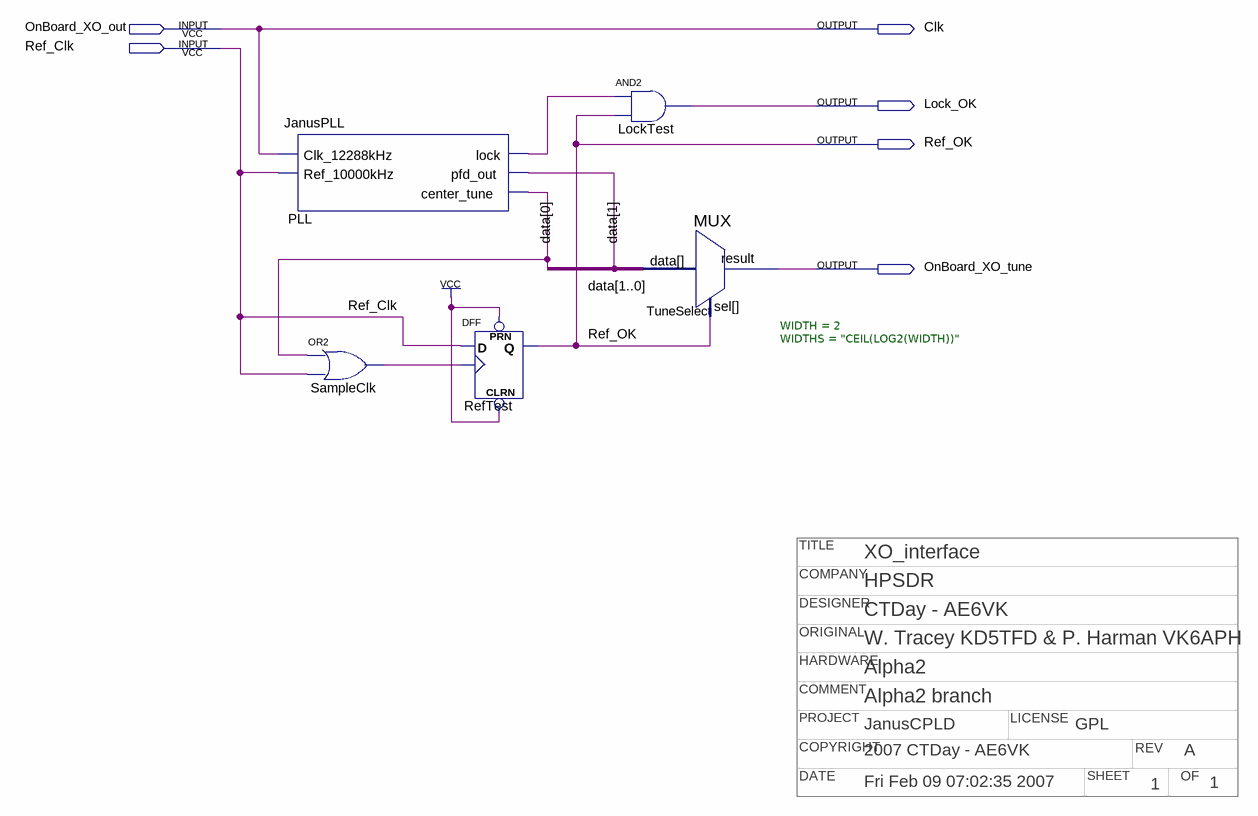
[diagram p0: schematic sheet]
// Quartus schematic XO_interface.bdf as structural Verilog: 5 symbols, 6 pins
// Title block: TITLE: XO_interface; COMPANY: HPSDR; DESIGNER: CTDay - AE6VK; COPYRIGHT: 2007 CTDay - AE6VK; REV: A; DATE: Fri Feb 09 07:02:35 2007; SHEET: 1; OF: 1; ORIGINAL: W. Tracey KD5TFD & P. Harman VK6APH; HARDWARE: Alpha2; COMMENT: Alpha2 branch; PROJECT: JanusCPLD; LICENSE: GPL
module XO_interface (
  input  OnBoard_XO_out,
  input  Ref_Clk,
  output Clk,
  output Lock_OK,
  output Ref_OK,
  output OnBoard_XO_tune
);

  wire PLL_lock, SampleClk_out;
  wire [1:0] data;

  JanusPLL PLL (
    .Ref_10000kHz(Ref_Clk), .Clk_12288kHz(OnBoard_XO_out), .lock(PLL_lock), .pfd_out(data[1]),
    .center_tune(data[0]));
  or SampleClk (SampleClk_out, data[0], Ref_Clk);
  DFF RefTest (.CLRN(1'b1), .CLK(SampleClk_out), .D(Ref_Clk), .PRN(1'b1), .Q(Ref_OK));
  and LockTest (Lock_OK, PLL_lock, Ref_OK);
  MUX #(.WIDTH(2), .WIDTHS("CEIL(LOG2(WIDTH))")) TuneSelect (.data(data), .sel(Ref_OK), .result(OnBoard_XO_tune));

  assign Clk = OnBoard_XO_out;
endmodule
